# EAGLE design MRCS-odTester (EAGLE 7.7.0)
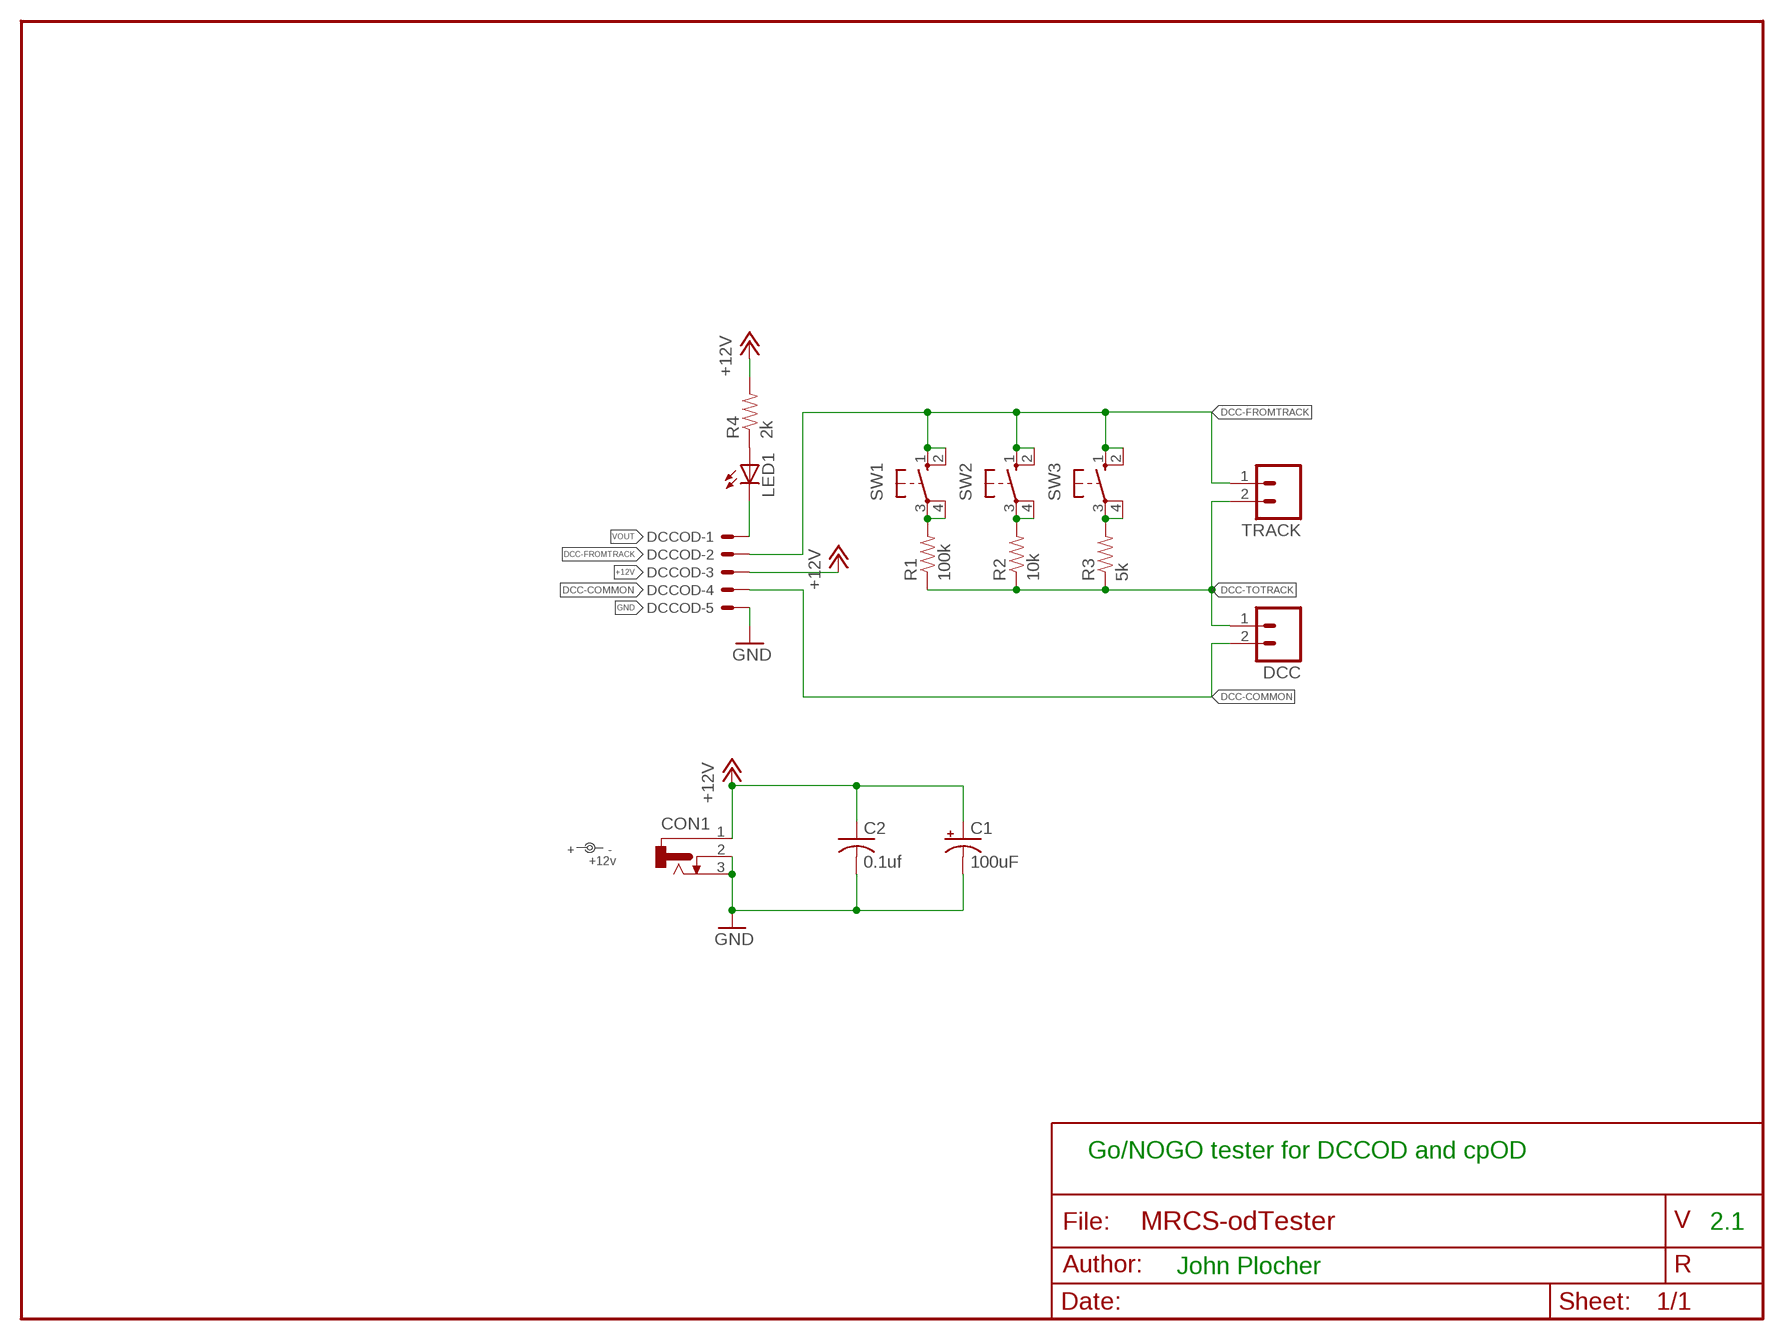
[diagram p0: schematic, sheet 1]

## Parts
C1  100uF  CAP-POLPTH-3.5MM  [E3.5-10]
C2  0.1uf  CAPPTH1  [C050-024X044]
CON1  CONNECTOR-DC-POWER-RA  [DCJ0202]
DCC  CONNECTOR-M02508-LOCK  [MSTB2]
DCCOD  KK-156-5  [KK-156-5]
LED1  LEDLED5MM  [LED5MM]
R1  100k  RPTH04  [AXIAL-0.4-RES]
R2  10k  RPTH04  [AXIAL-0.4-RES]
R3  5k  RPTH04  [AXIAL-0.4-RES]
R4  2k  RPTH04  [AXIAL-0.4-RES]
SW1  SWITCH-10-XX  [B3F-10XX]
SW2  SWITCH-10-XX  [B3F-10XX]
SW3  SWITCH-10-XX  [B3F-10XX]
TRACK  CONNECTOR-M02508-LOCK  [MSTB2]
U$1  +12v  DOC-POWER_LABEL  [PWR_LABEL]

## Nets
+12V: C1.+ C2.1 CON1.1 DCCOD.3 R4.P$2
DCC-COMMON: DCC.2(B) DCCOD.4
DCC-FROMTRACK: DCCOD.2 SW1.1(S) SW1.2(S1) SW2.1(S) SW2.2(S1) SW3.1(S) SW3.2(S1) TRACK.1(A)
DCC-TOTRACK: DCC.1(A) R1.P$1 R2.P$1 R3.P$1 TRACK.2(B)
GND: C1.- C2.2 CON1.2 CON1.3 DCCOD.5
N$1: R1.P$2 SW1.3(P) SW1.4(P1)
N$2: R2.P$2 SW2.3(P) SW2.4(P1)
N$3: R3.P$2 SW3.3(P) SW3.4(P1)
N$5: LED1.A R4.P$1
VOUT: DCCOD.1 LED1.K(C)

## Notes on the sheet
- Go/NOGO tester for DCCOD and cpOD
- 2.1
- John Plocher

## Library data of the parts
C1 = SPCoast:CAP-POL*
C2 = SPCoast:CAP*
CON1 = SPCoast:CONNECTOR-DC-POWER: DC POWER JACK
DCC TRACK = SPCoast:CONNECTOR-M02: PHOENIX CONNECTOR
DCCOD = con-molex:KK-156-5: KK 156 HEADER Source: http://www.molex.com/pdm_docs/sd/026604100_sd.pdf; OC_FARNELL: unknown; OC_NEWARK: unknown
LED1 = SPCoast:LED*
R1-R4 = SPCoast:R*: Resistor Basic schematic elements and footprints for 0603, 1206, and PTH 1/10th watt (small) resistors.
SW1-SW3 = SPCoast:SWITCH-10-XX: OMRON SWITCH
U$1 = SPCoast:DOC-POWER_LABEL

## Board
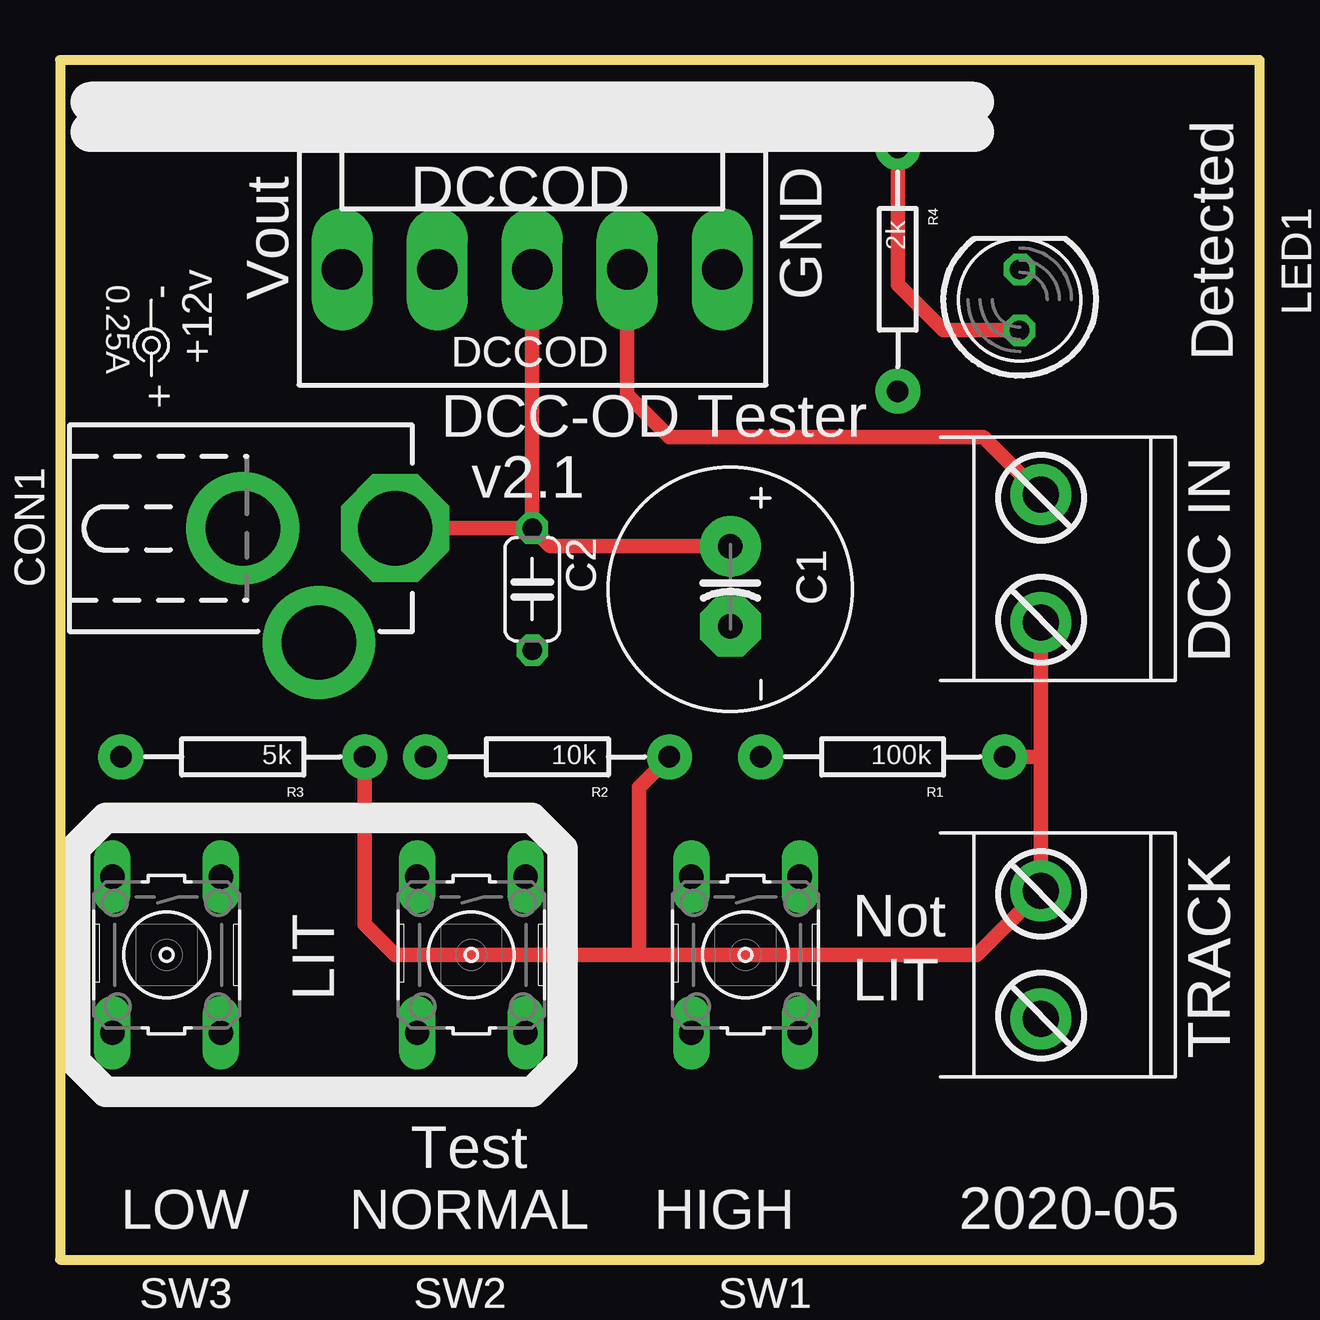
[diagram p1: board, top side]
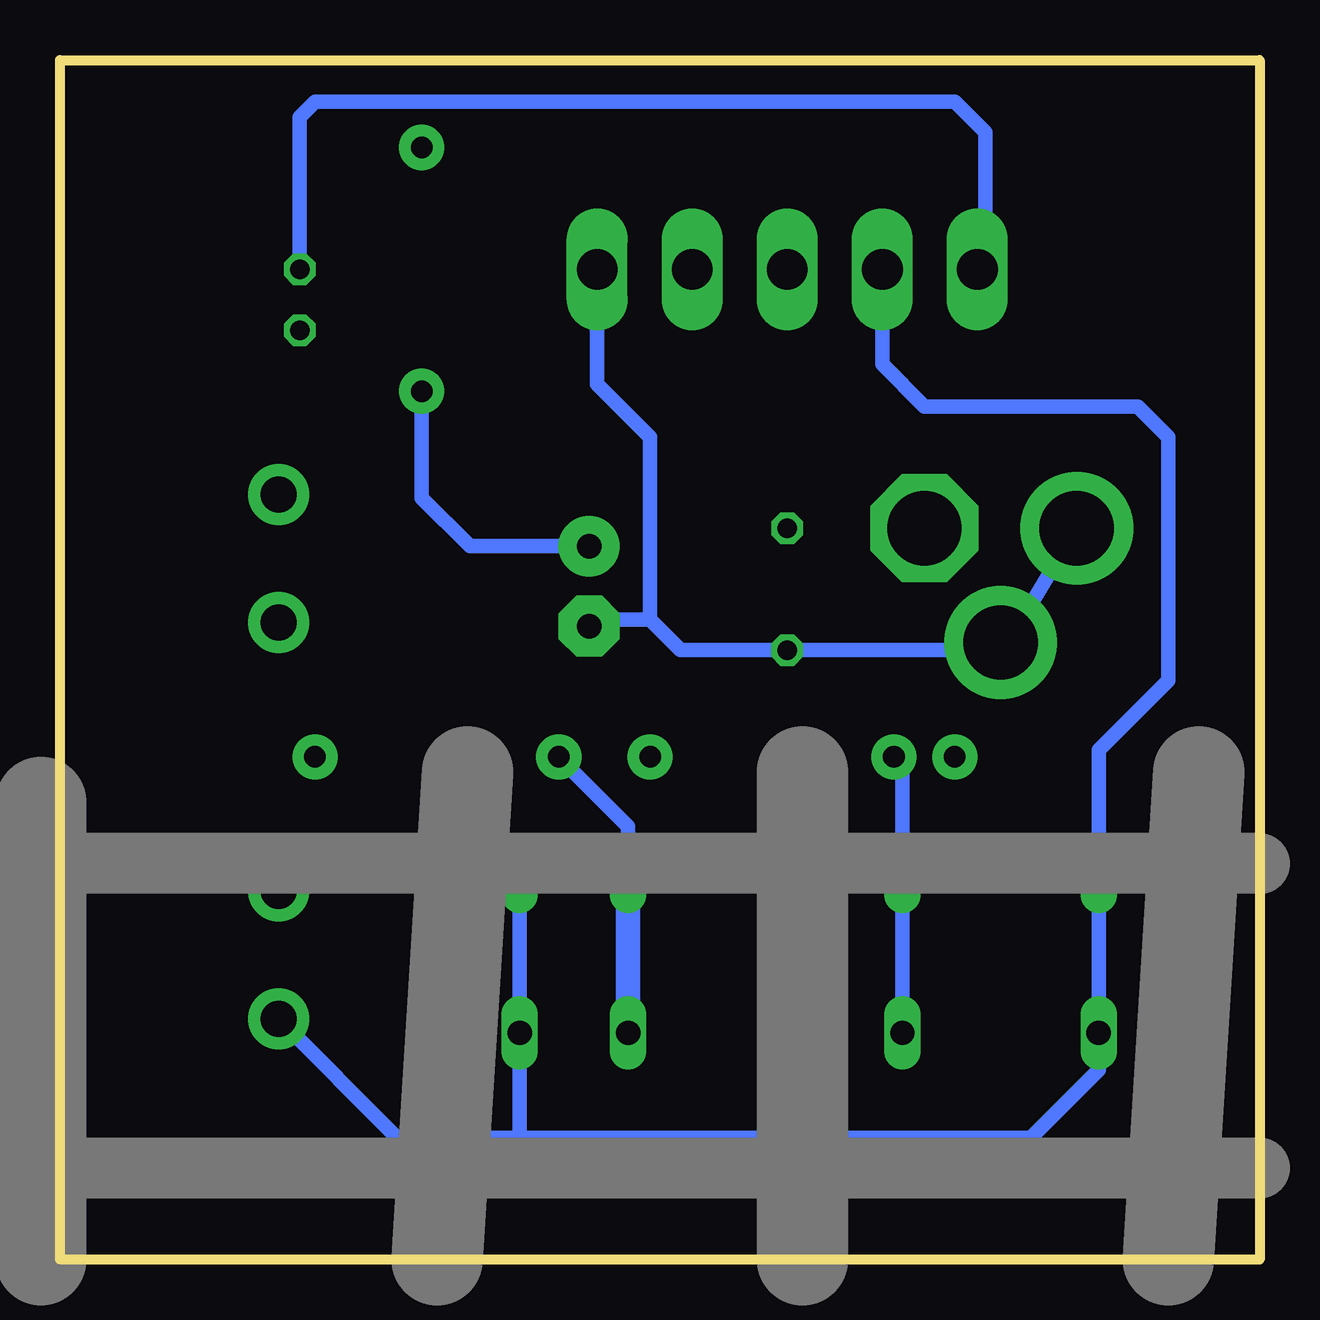
[diagram p2: board, bottom side, seen from below]

Size 50 x 50 mm. Coordinates in mm from the lower left corner, seen from the top.
Outline: 0,50 0,0 50,0 50,50 0,50
Copper layers (1*16): Top 0.035mm / dielectric 1.5mm / Bottom 0.035mm
Design rules "default": minimum track width 10mil, minimum drill 0.6mm, track to track 8mil, track to pad 8mil, pad to pad 8mil, via to via 8mil, smd to smd 8mil, copper to edge 40mil, drill to drill 8mil, minimum pad ring 10mil, minimum via ring 8mil, stop-mask expansion 4mil, vias tented up to drill 0mil, thermal gap 10mil

### Footprints (pad centres in the part's own frame; a part is rotated, then mirrored left to right if it is on the bottom)
E3.5-10 = drill 1.016 pad 2.54: + -1.79,0 | drill 1.016 pad 2.54 octagon: - 1.54,0
C050-024X044 = drill 0.813 octagon: 1 -2.54,0; 2 2.54,0
DCJ0202 = drill 3.1 pad 4.5 octagon: 1 0,3.175 | drill 3.1 pad 4.7: 2 4.763,0; 3 0,-3.175
MSTB2 = drill 1.5 pad 2.54: 1 -2.667,1.016; 2 2.667,1.016
KK-156-5 = drill 1.7 pad 2.184 long: 1 -7.92,0; 2 -3.96,0; 3 0,0; 4 3.96,0; 5 7.92,0
LED5MM = drill 0.813 octagon: A -1.27,0; K 1.27,0
AXIAL-0.4-RES = drill 0.9 pad 1.88: P$1 -5.08,0; P$2 5.08,0
B3F-10XX = drill 1.016 long: 1 -3.251,2.261; 2 3.251,2.261; 3 -3.251,-2.261; 4 3.251,-2.261

### Placement (x,y rotation side)
C1  27.94,27.94 270 top
C2  19.68,27.94 270 top
CON1  10.79,30.48 270 top
DCC  41.91,29.21 90 top
DCCOD  19.68,41.27 0 top
LED1  40.01,40.01 90 top
R1  34.29,20.95 180 top
R2  20.32,20.95 180 top
R3  7.62,20.95 180 top
R4  34.92,41.27 270 top
SW1  28.57,12.7 270 top
SW2  17.14,12.7 270 top
SW3  4.45,12.7 270 top
TRACK  41.91,12.7 90 top
U$1  3.81,38.1 180 top

### Tracks (layer width: path | path; a pad name or v marks a point on that pad's centre or on a via)
+12V
  Top 0.61: CON1.1 C2.1 | DCCOD.3 C2.1 | C2.1 20.43,29.73 C1.+
  Bottom 0.61: R4.P$2 34.92,31.75 32.91,29.73 C1.+
DCC-COMMON
  Top 0.61: DCCOD.4 23.64,36.05 25.4,34.29 38.48,34.29 DCC.2
DCC-FROMTRACK
  Bottom 0.61: SW2.1 SW2.2 19.41,5.08 | SW1.1 SW1.2 30.84,5.08 | TRACK.1 35.94,5.08 30.84,5.08 | 30.84,5.08 19.41,5.08 | 19.41,5.08 9.53,5.08 6.71,7.9 SW3.2 SW3.1 6.71,21.23 3.81,24.13 3.81,34.29 5.08,35.56 13.97,35.56 15.72,37.31 DCCOD.2
DCC-TOTRACK
  Top 0.61: 24.13,12.7 38.23,12.7 TRACK.2 40.89,20.95 | 24.13,12.7 13.97,12.7 12.7,13.97 R3.P$1 | DCC.1 40.89,20.95 | R1.P$1 40.89,20.95 | R2.P$1 24.13,19.68 24.13,12.7
GND
  Bottom 0.61: CON1.3 9.53,27.3 CON1.2 10.79,25.4 C2.2 24.13,25.4 25.4,26.67 | DCCOD.5 27.61,36.49 25.4,34.29 25.4,26.67 | C1.- 27.67,26.67 25.4,26.67
N$1
  Bottom 0.61: R1.P$2 26.31,18.06 SW1.3
  Bottom 1.016: SW1.3 SW1.4
N$2
  Bottom 0.61: SW2.4 SW2.3 14.88,20.68 R2.P$2
N$3
  Bottom 0.61: R3.P$2 2.18,20.04 SW3.3 SW3.4
N$5
  Top 0.61: R4.P$1 34.92,40.64 36.83,38.73 LED1.A
VOUT
  Bottom 0.61: LED1.K 40.01,47.62 39.37,48.26 12.7,48.26 11.43,46.99 11.43,41.61 DCCOD.1

### Text on the board
tPlace: DCCOD | 0.25A | Vout | GND | Detected | DCC-OD Tester | v2.1 | DCC IN | LIT | Not / LIT | TRACK | Test | LOW | NORMAL | HIGH | 2020-05
bDocu: Model Railroading / is Fun! | If only "low" lights, the detector is not sensitive enough | "Low" and "Normal" lights is a PASS | If all three light, the detector is too sensitive | Made in the PCR, / Coast Div, NMRA | DCCOD Tester | Adjust for Normal Detection / and not too High | Go Bears! | www.SPCoast.com
_tNames: R4 | LED1 | DCCOD | CON1 | C2 | C1 | DCC | R3 | R2 | R1 | TRACK | SW3 | SW2 | SW1